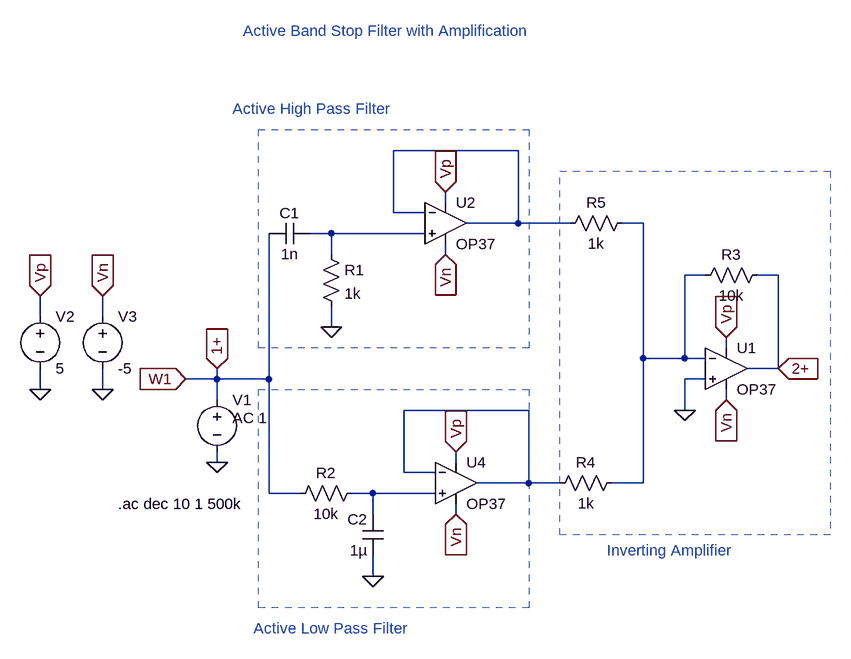
[diagram p0: schematic absf_gain.asc]
absf_gain.asc, the LTspice schematic file:
Version 4
SHEET 1 920 836
WIRE 192 -240 0 -240
WIRE 80 -160 80 -176
WIRE 0 -144 0 -240
WIRE 48 -144 0 -144
WIRE 192 -128 192 -240
WIRE 192 -128 112 -128
WIRE 272 -128 192 -128
WIRE 384 -128 352 -128
WIRE -96 -112 -128 -112
WIRE 48 -112 -96 -112
WIRE -96 -80 -96 -112
WIRE 80 -80 80 -96
WIRE 480 -48 448 -48
WIRE 592 -48 560 -48
WIRE -544 16 -544 -16
WIRE -448 16 -448 -16
WIRE -96 32 -96 0
WIRE 512 64 512 48
WIRE 384 80 384 -128
WIRE 448 80 448 -48
WIRE 448 80 384 80
WIRE 480 80 448 80
WIRE 592 96 592 -48
WIRE 592 96 544 96
WIRE -272 112 -272 96
WIRE -272 112 -320 112
WIRE -192 112 -192 -112
WIRE -192 112 -272 112
WIRE 480 112 448 112
WIRE -544 128 -544 96
WIRE -448 128 -448 96
WIRE -272 144 -272 112
WIRE 512 144 512 128
WIRE 208 160 16 160
WIRE 448 160 448 112
WIRE -272 240 -272 224
WIRE 96 240 96 224
WIRE 16 256 16 160
WIRE 64 256 16 256
WIRE 208 272 208 160
WIRE 208 272 128 272
WIRE 256 272 208 272
WIRE 384 272 384 80
WIRE 384 272 336 272
WIRE -192 288 -192 112
WIRE -144 288 -192 288
WIRE -32 288 -64 288
WIRE 64 288 -32 288
WIRE -32 320 -32 288
WIRE 96 320 96 304
WIRE -32 416 -32 384
FLAG -96 32 0
FLAG -272 240 0
FLAG -544 128 0
FLAG -448 128 0
FLAG -544 -16 Vp
IOPIN -544 -16 In
FLAG -448 -16 Vn
IOPIN -448 -16 In
FLAG 80 -176 Vp
IOPIN 80 -176 In
FLAG 80 -80 Vn
IOPIN 80 -80 In
FLAG -320 112 W1
IOPIN -320 112 In
FLAG -272 96 1+
IOPIN -272 96 In
FLAG -32 416 0
FLAG 96 224 Vp
IOPIN 96 224 In
FLAG 96 320 Vn
IOPIN 96 320 In
FLAG 592 96 2+
IOPIN 592 96 In
FLAG 448 160 0
FLAG 512 48 Vp
IOPIN 512 48 In
FLAG 512 144 Vn
IOPIN 512 144 In
SYMBOL cap -128 -128 R90
WINDOW 0 0 32 VBottom 2
WINDOW 3 32 32 VTop 2
SYMATTR InstName C1
SYMATTR Value 1n
SYMBOL res -112 -96 R0
SYMATTR InstName R1
SYMATTR Value 1k
SYMBOL voltage -272 128 R0
WINDOW 123 24 44 Left 2
WINDOW 39 0 0 Left 0
SYMATTR Value2 AC 1
SYMATTR InstName V1
SYMATTR Value ""
SYMBOL voltage -544 0 R0
WINDOW 123 0 0 Left 0
WINDOW 39 0 0 Left 0
SYMATTR InstName V2
SYMATTR Value 5
SYMBOL voltage -448 0 R0
WINDOW 123 0 0 Left 0
WINDOW 39 0 0 Left 0
SYMATTR InstName V3
SYMATTR Value -5
SYMBOL res -48 272 R90
WINDOW 0 0 56 VBottom 2
WINDOW 3 32 56 VTop 2
SYMATTR InstName R2
SYMATTR Value 10k
SYMBOL cap -16 384 R180
WINDOW 0 24 56 Left 2
WINDOW 3 24 8 Left 2
SYMATTR InstName C2
SYMATTR Value 1µ
SYMBOL res 368 -144 R90
WINDOW 0 0 56 VBottom 2
WINDOW 3 32 56 VTop 2
SYMATTR InstName R5
SYMATTR Value 1k
SYMBOL res 576 -64 R90
WINDOW 0 0 56 VBottom 2
WINDOW 3 32 56 VTop 2
SYMATTR InstName R3
SYMATTR Value 10k
SYMBOL res 352 256 R90
WINDOW 0 0 56 VBottom 2
WINDOW 3 32 56 VTop 2
SYMATTR InstName R4
SYMATTR Value 1k
SYMBOL Opamps\\OP37 96 208 R0
SYMATTR InstName U4
SYMBOL Opamps\\OP37 80 -192 R0
SYMATTR InstName U2
SYMBOL Opamps\\OP37 512 32 R0
SYMATTR InstName U1
TEXT -232 -424 Left 2 ;Active Band Stop Filter with Amplification
TEXT -424 304 Left 2 !.ac dec 10 1 500k
TEXT -248 -304 Left 2 ;Active High Pass Filter
TEXT -216 496 Left 2 ;Active Low Pass Filter
TEXT 328 376 Left 2 ;Inverting Amplifier
RECTANGLE Normal 208 64 -208 -272 2
RECTANGLE Normal 208 464 -208 128 2
RECTANGLE Normal 672 352 256 -208 2

The netlist it stands for:
* absf_gain.asc
C1 N003 1+ 1n
R1 N003 0 1k
V1 1+ 0 AC 1
V2 Vp 0 5
V3 Vn 0 -5
R2 N005 1+ 10k
C2 0 N005 1µ
R5 N002 N001 1k
R3 2+ N002 10k
R4 N002 N004 1k
XU4 N005 N004 Vp Vn N004 LT1037  ; OP37, pins In+ In- V+ V- OUT
XU2 N003 N001 Vp Vn N001 LT1037  ; OP37, pins In+ In- V+ V- OUT
XU1 0 N002 Vp Vn 2+ LT1037  ; OP37, pins In+ In- V+ V- OUT
* Active Band Stop Filter with Amplification
.ac dec 10 1 500k
* Active High Pass Filter
* Active Low Pass Filter
* Inverting Amplifier
.lib LTC.lib
.backanno
.end